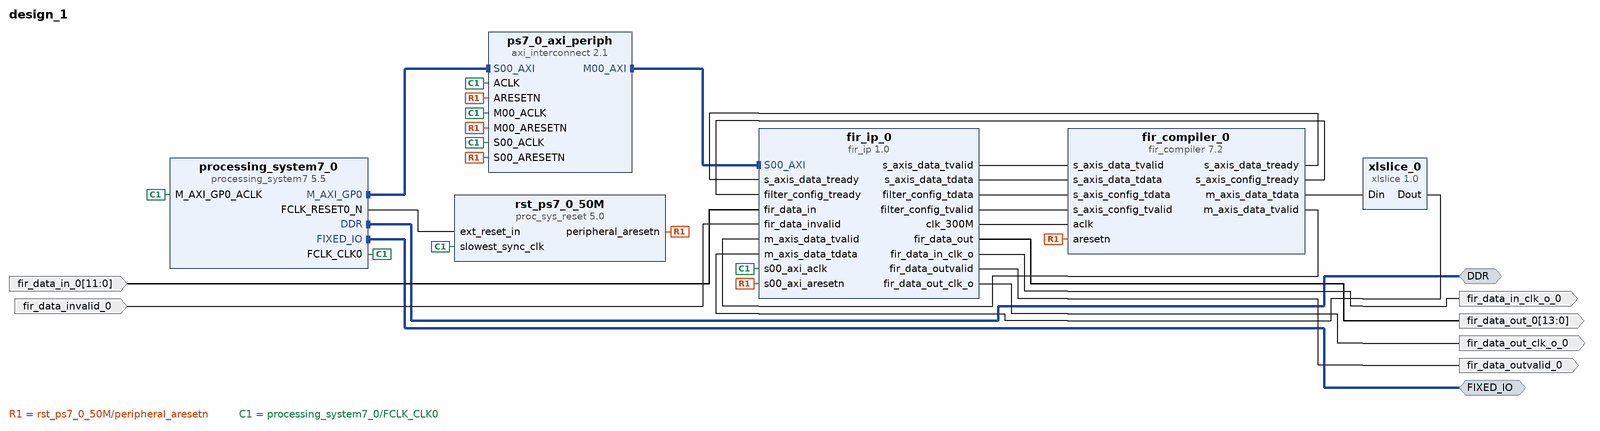
[diagram p0: block diagram of the top level]
# Vivado block design design_1, xc7z010clg400-1, Vivado 2020.2
create_bd_design design_1

create_bd_intf_port -mode Master -vlnv xilinx.com:interface:ddrx_rtl:1.0 DDR
create_bd_intf_port -mode Master -vlnv xilinx.com:display_processing_system7:fixedio_rtl:1.0 FIXED_IO
create_bd_port -dir I -from 11 -to 0 fir_data_in_0
create_bd_port -dir I fir_data_invalid_0
create_bd_port -dir O -from 13 -to 0 fir_data_out_0
create_bd_port -dir O fir_data_outvalid_0
create_bd_port -dir O fir_data_in_clk_o_0
create_bd_port -dir O fir_data_out_clk_o_0

create_bd_cell -type ip -vlnv xilinx.com:ip:fir_compiler:7.2 fir_compiler_0
set_property -dict [list \
  CONFIG.Clock_Frequency 200 \
  CONFIG.CoefficientSource COE_File \
  CONFIG.Coefficient_Fanout true \
  CONFIG.Coefficient_File ../../../../../../fir_coe20.ip_user_files/mem_init_files/untitled.coe \
  CONFIG.Coefficient_Fractional_Bits 0 \
  CONFIG.Coefficient_Reload true \
  CONFIG.Coefficient_Sets 2 \
  CONFIG.Coefficient_Sign Signed \
  CONFIG.Coefficient_Structure Inferred \
  CONFIG.Coefficient_Width 16 \
  CONFIG.ColumnConfig 8 \
  CONFIG.Control_Broadcast_Fanout true \
  CONFIG.Control_Column_Fanout true \
  CONFIG.Control_LUT_Pipeline true \
  CONFIG.Control_Path_Fanout true \
  CONFIG.Data_Path_Broadcast false \
  CONFIG.Data_Path_Fanout true \
  CONFIG.Data_Width 16 \
  CONFIG.Disable_Half_Band_Centre_Tap false \
  CONFIG.Filter_Architecture Systolic_Multiply_Accumulate \
  CONFIG.Filter_Selection 1 \
  CONFIG.Has_ARESETn true \
  CONFIG.No_BRAM_Read_First_Mode true \
  CONFIG.No_SRL_Attributes false \
  CONFIG.Optimal_Column_Lengths true \
  CONFIG.Optimization_Goal Speed \
  CONFIG.Optimization_List Data_Path_Fanout,Pre-Adder_Pipeline,Coefficient_Fanout,Control_Path_Fanout,Control_Column_Fanout,Control_Broadcast_Fanout,Control_LUT_Pipeline,No_BRAM_Read_First_Mode,Optimal_Column_Lengths,Other \
  CONFIG.Optimization_Selection All \
  CONFIG.Other true \
  CONFIG.Output_Width 42 \
  CONFIG.Pre_Adder_Pipeline true \
  CONFIG.Quantization Integer_Coefficients \
  CONFIG.Sample_Frequency 5 \
] [get_bd_cells fir_compiler_0]
create_bd_cell -type ip -vlnv xilinx.com:ip:processing_system7:5.5 processing_system7_0
set_property -dict [list \
  CONFIG.PCW_UART0_PERIPHERAL_ENABLE 1 \
  CONFIG.PCW_UART0_UART0_IO {MIO 14 .. 15} \
  CONFIG.PCW_UART_PERIPHERAL_FREQMHZ 100 \
  CONFIG.PCW_UIPARAM_DDR_BUS_WIDTH {16 Bit} \
  CONFIG.PCW_UIPARAM_DDR_PARTNO {MT41J256M16 RE-125} \
] [get_bd_cells processing_system7_0]
# 43 more settings of processing_system7_0 are not shown: defaults, MIO pin electricals, DDR timing, and values the tool derives
create_bd_cell -type ip -vlnv xilinx.com:ip:axi_interconnect:2.1 ps7_0_axi_periph
set_property -dict {CONFIG.NUM_MI 1} [get_bd_cells ps7_0_axi_periph]
create_bd_cell -type ip -vlnv xilinx.com:ip:proc_sys_reset:5.0 rst_ps7_0_50M
create_bd_cell -type ip -vlnv xilinx.com:ip:xlslice:1.0 xlslice_0
set_property -dict {CONFIG.DIN_FROM 41 CONFIG.DIN_TO 0 CONFIG.DIN_WIDTH 48 CONFIG.DOUT_WIDTH 42} [get_bd_cells xlslice_0]
create_bd_cell -type ip -vlnv xilinx.com:user:fir_ip:1.0 fir_ip_0

# ---- connections ----

connect_bd_intf_net [get_bd_intf_pins processing_system7_0/M_AXI_GP0] [get_bd_intf_pins ps7_0_axi_periph/S00_AXI]
connect_bd_intf_net [get_bd_intf_pins ps7_0_axi_periph/M00_AXI] [get_bd_intf_pins fir_ip_0/S00_AXI]
connect_bd_intf_net [get_bd_intf_ports DDR] [get_bd_intf_pins processing_system7_0/DDR]
connect_bd_intf_net [get_bd_intf_ports FIXED_IO] [get_bd_intf_pins processing_system7_0/FIXED_IO]
connect_bd_net [get_bd_pins processing_system7_0/FCLK_RESET0_N] [get_bd_pins rst_ps7_0_50M/ext_reset_in]
connect_bd_net [get_bd_pins rst_ps7_0_50M/peripheral_aresetn] \
  [get_bd_pins ps7_0_axi_periph/S00_ARESETN] [get_bd_pins ps7_0_axi_periph/M00_ARESETN] \
  [get_bd_pins ps7_0_axi_periph/ARESETN] [get_bd_pins fir_compiler_0/aresetn] [get_bd_pins fir_ip_0/s00_axi_aresetn]
connect_bd_net [get_bd_pins fir_compiler_0/m_axis_data_tdata] [get_bd_pins xlslice_0/Din]
connect_bd_net [get_bd_pins fir_ip_0/fir_data_out] [get_bd_ports fir_data_out_0]
connect_bd_net [get_bd_pins fir_compiler_0/s_axis_data_tready] [get_bd_pins fir_ip_0/s_axis_data_tready]
connect_bd_net [get_bd_pins fir_ip_0/s_axis_data_tvalid] [get_bd_pins fir_compiler_0/s_axis_data_tvalid]
connect_bd_net [get_bd_pins fir_ip_0/fir_data_in_clk_o] [get_bd_ports fir_data_in_clk_o_0]
connect_bd_net [get_bd_pins fir_compiler_0/s_axis_config_tready] [get_bd_pins fir_ip_0/filter_config_tready]
connect_bd_net [get_bd_pins xlslice_0/Dout] [get_bd_pins fir_ip_0/m_axis_data_tdata]
connect_bd_net [get_bd_pins fir_ip_0/fir_data_outvalid] [get_bd_ports fir_data_outvalid_0]
connect_bd_net [get_bd_pins fir_ip_0/s_axis_data_tdata] [get_bd_pins fir_compiler_0/s_axis_data_tdata]
connect_bd_net [get_bd_pins fir_ip_0/fir_data_out_clk_o] [get_bd_ports fir_data_out_clk_o_0]
connect_bd_net [get_bd_pins fir_ip_0/filter_config_tdata] [get_bd_pins fir_compiler_0/s_axis_config_tdata]
connect_bd_net -net fir_data_in_0_1 [get_bd_ports fir_data_in_0] [get_bd_pins fir_ip_0/fir_data_in]
connect_bd_net [get_bd_pins fir_ip_0/filter_config_tvalid] [get_bd_pins fir_compiler_0/s_axis_config_tvalid]
connect_bd_net [get_bd_pins fir_compiler_0/m_axis_data_tvalid] [get_bd_pins fir_ip_0/m_axis_data_tvalid]
connect_bd_net -net fir_data_invalid_0_1 [get_bd_ports fir_data_invalid_0] [get_bd_pins fir_ip_0/fir_data_invalid]
connect_bd_net [get_bd_pins fir_ip_0/clk_300M] [get_bd_pins fir_compiler_0/aclk]
connect_bd_net [get_bd_pins processing_system7_0/FCLK_CLK0] \
  [get_bd_pins ps7_0_axi_periph/M00_ACLK] [get_bd_pins processing_system7_0/M_AXI_GP0_ACLK] \
  [get_bd_pins ps7_0_axi_periph/S00_ACLK] [get_bd_pins ps7_0_axi_periph/ACLK] [get_bd_pins rst_ps7_0_50M/slowest_sync_clk] \
  [get_bd_pins fir_ip_0/s00_axi_aclk]

# ---- address map ----
assign_bd_address -offset 0x43C00000 -range 64K -target_address_space [get_bd_addr_spaces processing_system7_0/Data] [get_bd_addr_segs fir_ip_0/S00_AXI/S00_AXI_reg]

validate_bd_design
save_bd_design
